# Altium schematic sheet [08] - LCD and Keyboard.SchDoc
size A
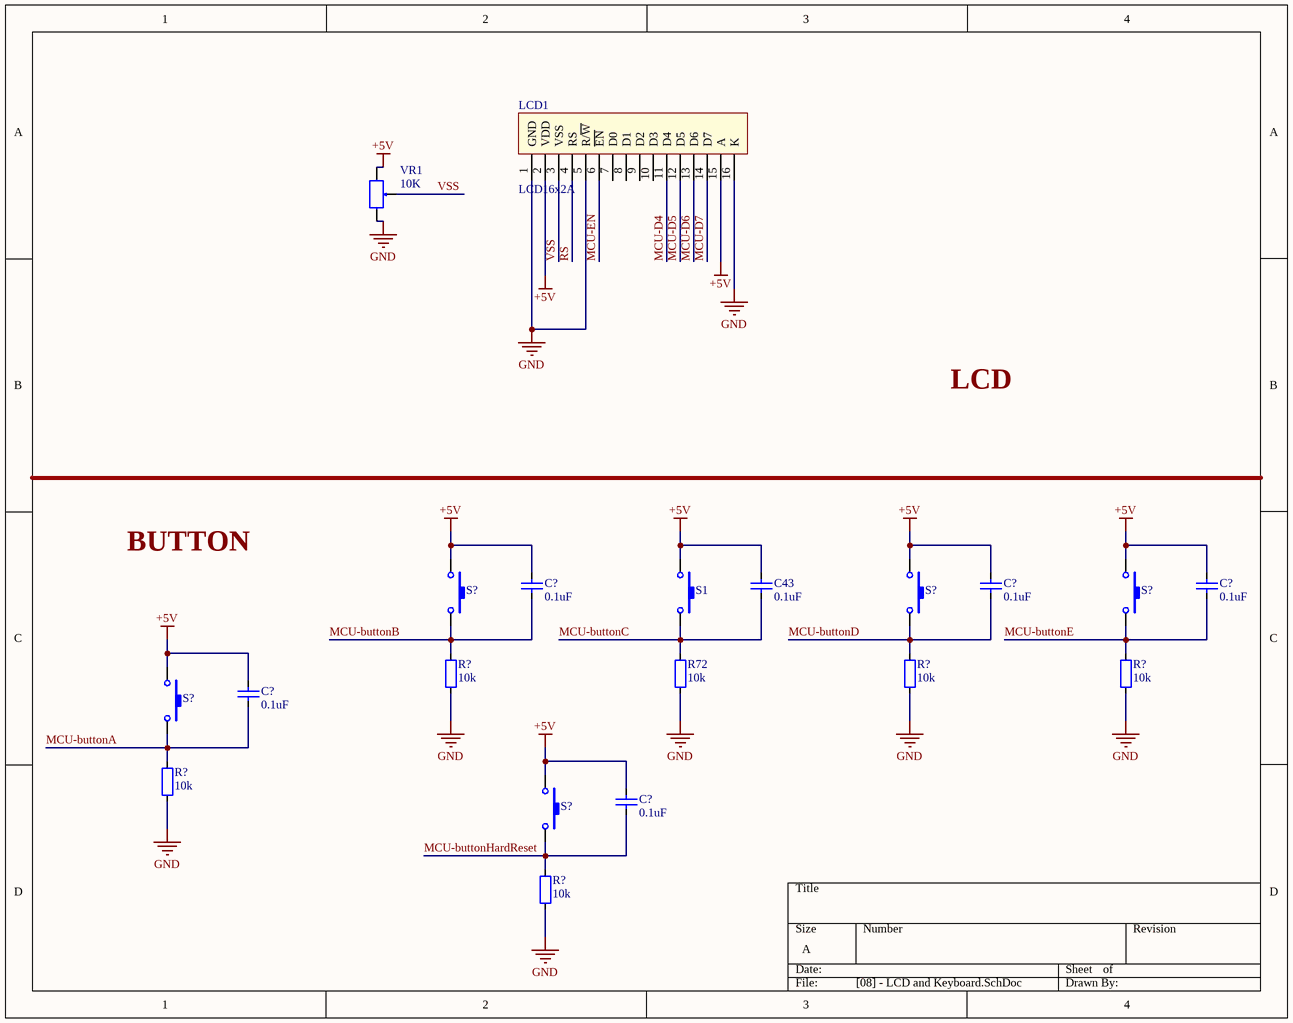
[diagram p0: [08] - LCD and Keyboard.SchDoc]

## Parts
(Parts that share a designator on the sheet are numbered #1, #2 ... from top to bottom, then left to right.)
C43  0.1uF  [CAP_0402]
C?#1  0.1uF  [CAP_0402]
C?#2  0.1uF  [CAP_0402]
C?#3  0.1uF  [CAP_0402]
C?#4  0.1uF  [CAP_0402]
C?#5  0.1uF  [CAP_0402]
LCD1  LCD16x2A  [LCD16X2]
R72  10k  [RES-SMD-0101]
R?#1  10k  [RES-SMD-0101]
R?#2  10k  [RES-SMD-0101]
R?#3  10k  [RES-SMD-0101]
R?#4  10k  [RES-SMD-0101]
R?#5  10k  [RES-SMD-0101]
S1  SW-SMD  [SW-SMD]  (value not drawn)
S?#1  SW-SMD  [SW-SMD]  (value not drawn)
S?#2  SW-SMD  [SW-SMD]  (value not drawn)
S?#3  SW-SMD  [SW-SMD]  (value not drawn)
S?#4  SW-SMD  [SW-SMD]  (value not drawn)
S?#5  SW-SMD  [SW-SMD]  (value not drawn)
VR1  10K  [VR]

## Nets
+5V: C43.2 C?#1.2 C?#2.2 C?#3.2 C?#4.2 C?#5.2 LCD1.2(VDD) LCD1.15(A) S1.1 S?#1.1 S?#2.1 S?#3.1 S?#4.1 S?#5.1 VR1.1
GND: LCD1.1(GND) LCD1.5(R/~{W}) LCD1.16(K) R72.2 R?#1.2 R?#2.2 R?#3.2 R?#4.2 R?#5.2 VR1.3
MCU-buttonA: C?#4.1 R?#4.1 S?#4.2
MCU-buttonB: C?#1.1 R?#1.1 S?#1.2
MCU-buttonC: C43.1 R72.1 S1.2
MCU-buttonD: C?#2.1 R?#2.1 S?#2.2
MCU-buttonE: C?#3.1 R?#3.1 S?#3.2
MCU-buttonHardReset: C?#5.1 R?#5.1 S?#5.2
MCU-D4: LCD1.11(D4)
MCU-D5: LCD1.12(D5)
MCU-D6: LCD1.13(D6)
MCU-D7: LCD1.14(D7)
MCU-EN: LCD1.6(~{EN})
RS: LCD1.4(RS)
VSS: LCD1.3(VSS) VR1.2

Not connected (* = marked no-connect by the designer): LCD1 7(D0) 8(D1) 9(D2) 10(D3)

## Notes on the sheet
- Labels drawn without touching a wire or pin: BUTTON, LCD

## Library data of the parts
C43 C?#1-C?#5 = CapSMD: Capacitor; Value: 33p; Published: 8-Jun-2000; LatestRevisionDate: 17-Jul-2002; LatestRevisionNote: Re-released for DXP Platform.; PackageReference: RAD-0.3; Publisher: Altium Limited
LCD1 = LCD16x2: LCD dipslay 16 char, 2 line; Value: LCD16x2A
R72 R?#1-R?#5 = Resistor - SMD: Resistor; Manufacturer: Generic Components; Class: Passive; Published: 08/06/2000; Publisher: Altium Hobart Technology Centre
S1 S?#1-S?#5 = SW-SMD: Switch; Published: 24-Mar-1999; LatestRevisionDate: 17-Jul-2002; LatestRevisionNote: Re-released for DXP Platform.; PackageReference: SPST-2; Publisher: Altium Limited
VR1 = VR: Var Resistor; Value: VR 10K